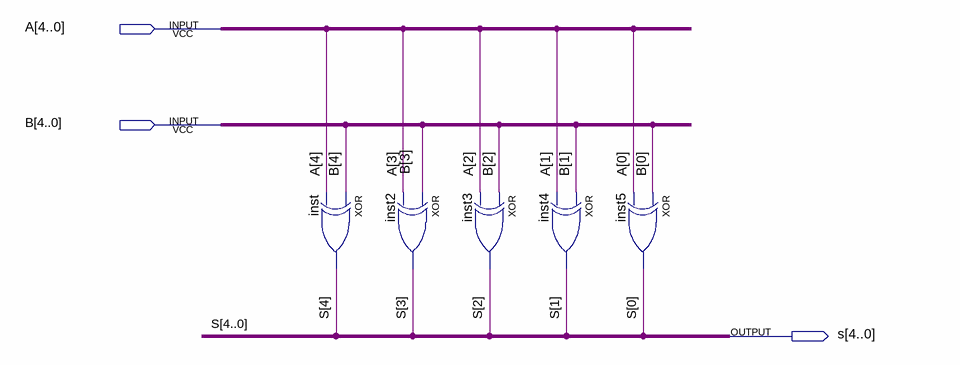
[diagram p0: schematic sheet]
// Quartus schematic Xor5bits.bdf as structural Verilog: 5 symbols, 3 pins
module Xor5bits (
  input  [4:0] A,
  input  [4:0] B,
  output [4:0] s
);

  xor inst (s[4], B[4], A[4]);
  xor inst2 (s[3], B[3], A[3]);
  xor inst3 (s[2], B[2], A[2]);
  xor inst4 (s[1], B[1], A[1]);
  xor inst5 (s[0], B[0], A[0]);
endmodule
